# Altium schematic sheet Circuitos_digital.SchDoc
size A4
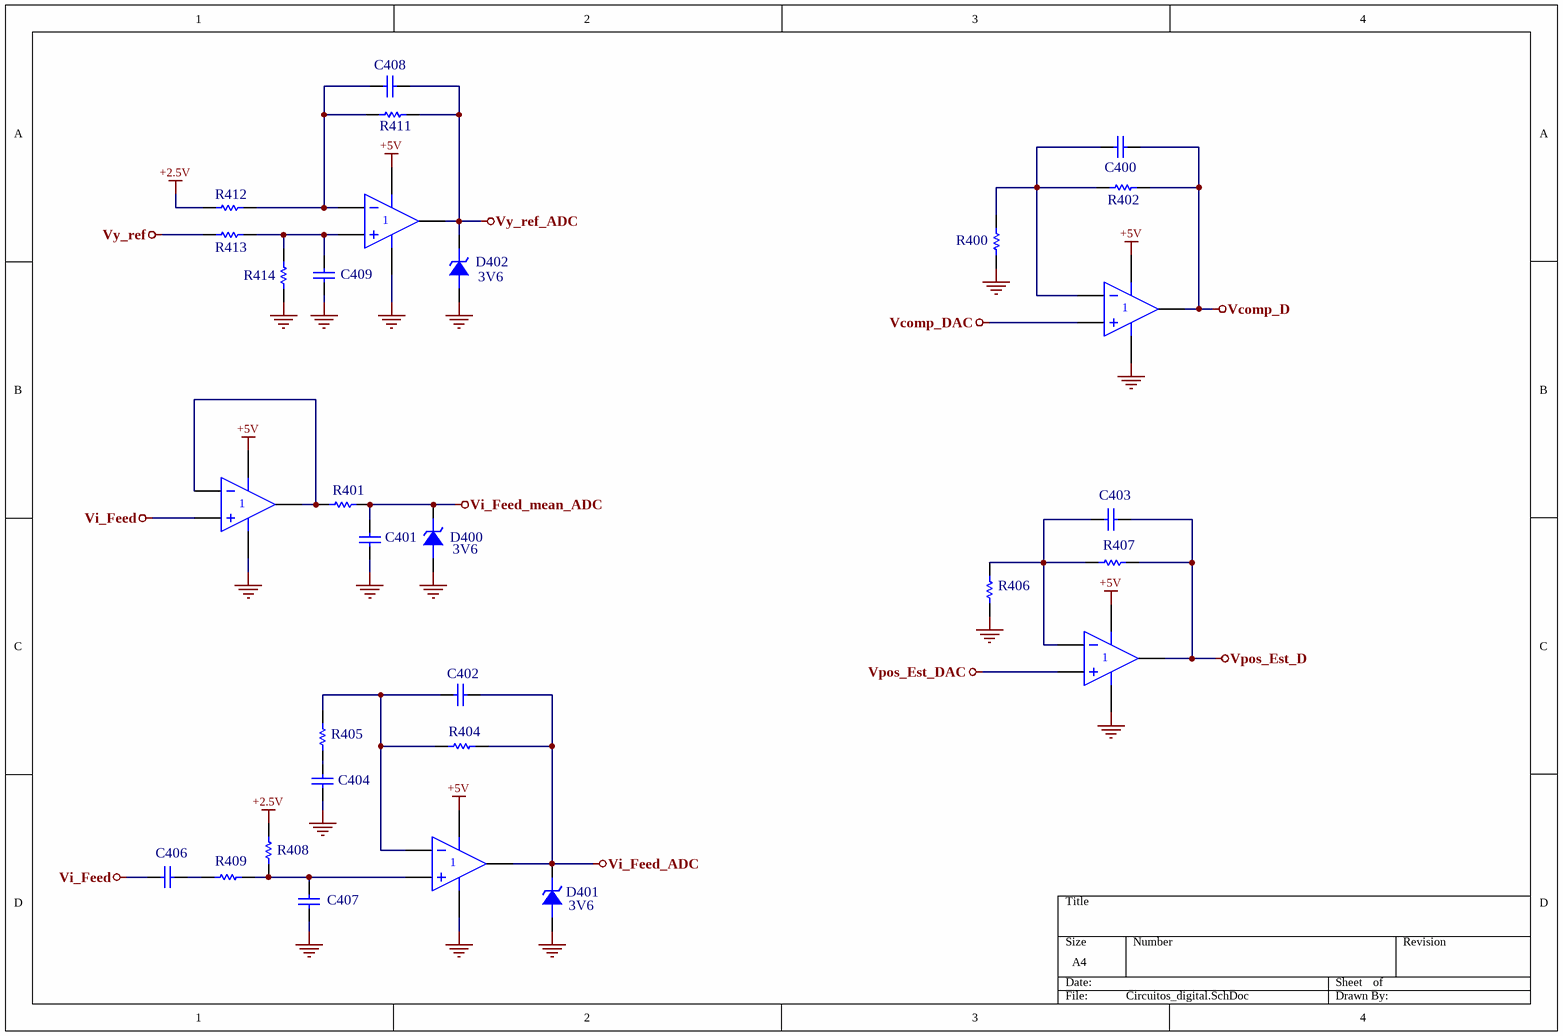
[diagram p0: Circuitos_digital.SchDoc]

## Parts
(Parts that share a designator on the sheet are numbered #1, #2 ... from top to bottom, then left to right.)
C400  Capacitor  [C1206]  (value not drawn)
C401  Capacitor  [C1206]  (value not drawn)
C402  Capacitor  [C1206]  (value not drawn)
C403  Capacitor  [C1206]  (value not drawn)
C404  Capacitor  [C1206]  (value not drawn)
C406  Capacitor  [C1206]  (value not drawn)
C407  Capacitor  [C1206]  (value not drawn)
C408  Capacitor  [C1206]  (value not drawn)
C409  Capacitor  [C1206]  (value not drawn)
D400  value 3V6  [SMB]  (hidden comment: Diodo Zener)
D401  value 3V6  [SMB]  (hidden comment: Diodo Zener)
D402  value 3V6  [SMB]  (hidden comment: Diodo Zener)
R400  10k  [R1206]  (value not drawn)
R401  10k  [R1206]  (value not drawn)
R402  5k  [R1206]  (value not drawn)
R404  50k  [R1206]  (value not drawn)
R405  1k  [R1206]  (value not drawn)
R406  10k  [R1206]  (value not drawn)
R407  5k  [R1206]  (value not drawn)
R408  50k  [R1206]  (value not drawn)
R409  1k  [R1206]  (value not drawn)
R411  10k  [R1206]  (value not drawn)
R412  10k  [R1206]  (value not drawn)
R413  10k  [R1206]  (value not drawn)
R414  10k  [R1206]  (value not drawn)
U66  MCP664  [SOIC14]  (value not drawn)  (part A of 4)
U67  MCP664  [SOIC14]  (value not drawn)  (part A of 4)
U?#1  MCP664  [SOIC14]  (value not drawn)  (part A of 4)
U?#2  MCP664  [SOIC14]  (value not drawn)  (part A of 4)
U?#3  MCP664  [SOIC14]  (value not drawn)  (part A of 4)

## Nets
+2.5V: R408.2 R412.1
+5V: U66.4(V+) U67.4(V+) U?#1.4(V+) U?#2.4(V+) U?#3.4(V+)
GND: C401.1 C404.2 C407.1 C409.2 D400.1 D401.1 D402.1 R400.1 R406.1 R414.1 U66.11(V-) U67.11(V-) U?#1.11(V-) U?#2.11(V-) U?#3.11(V-)
Vcomp_D: C400.1 R402.2 U66.1(OUT)
Vcomp_DAC: U66.3(IN+)
Vi_Feed: C406.1 U?#2.3(IN+)
Vi_Feed_ADC: C402.1 D401.2 R404.2 U?#3.1(OUT)
Vi_Feed_mean_ADC: C401.2 D400.2 R401.2
Vpos_Est_D: C403.1 R407.2 U67.1(OUT)
Vpos_Est_DAC: U67.3(IN+)
Vy_ref: R413.1
Vy_ref_ADC: C408.1 D402.2 R411.2 U?#1.1(OUT)
NetC400_2: C400.2 R400.2 R402.1 U66.2(IN-)
NetC402_2: C402.2 R404.1 R405.2 U?#3.2(IN-)
NetC403_2: C403.2 R406.2 R407.1 U67.2(IN-)
NetC404_1: C404.1 R405.1
NetC406_2: C406.2 R409.1
NetC407_2: C407.2 R408.1 R409.2 U?#3.3(IN+)
NetC408_2: C408.2 R411.1 R412.2 U?#1.2(IN-)
NetC409_1: C409.1 R413.2 R414.2 U?#1.3(IN+)
NetR401_1: R401.1 U?#2.1(OUT) U?#2.2(IN-)

## Library data of the parts
C400 C403 = Capacitor: CAP CER 0.018UF 100V X7R 1206; Mfr PN: C1206C183K1RAC7800; Manufacturer: KEMET; Value: 18nF; Supplier 1: Digi-Key; Supplier 1 PN: 399-C1206C183K1RAC7800CT-ND
C401 = Capacitor: CAP CER 0.15UF 50V X7R 1206; Mfr PN: 12065C154KAT2A; Manufacturer: KYOCERA AVX; Value: 150nF; Supplier 1: Digi-Key; Supplier 1 PN: 478-1558-1-ND
C402 C407 = Capacitor: CAP CER 270PF 50V C0G/NP0 1206; Mfr PN: C1206C271J5GAC7800; Manufacturer: KEMET; Supplier 1: Digi-Key; Supplier 1 PN: 399-14675-1-ND; Value: 270pF
C404 C406 = Capacitor: CAP CER 1.5UF 10V X7R 1206; Manufacturer: YAGEO; Mfr PN: CC1206KKX7R6BB155; Value: 1.6uF; Supplier 1: Digi-Key; Supplier 1 PN: 311-3452-1-ND
C408 C409 = Capacitor: CAP CER 1600PF 50V NP0 1206; Mfr PN: C1206C162J5GAC7800; Manufacturer: KEMET; Value: 1.6nF; Supplier 1: Digi-Key; Supplier 1 PN: 399-17466-1-ND
D400-D402 = Diodo Zener: DIODE ZENER 3.6V 3W SMB; Manufacturer: onsemi; Mfr PN: 1SMB5914BT3G; Supplier 1 PN: 1SMB5914BT3GOSCT-ND; Supplier 1: Digi-Key
R400 R401 R406 R411-R414 = R1206: RES 10K OHM 1% 1/4W 1206; Mfr PN: RC1206FR-0710KL; Manufacturer: YAGEO; PackageReference: 1206; Supplier 1 PN: 311-10.0KFRCT-ND; Supplier 1: Digi-Key; Value: 10k; Tolerance: 1%
R402 R407 = R1206: RES SMD 5K OHM 1% 0.3W 1206; Mfr PN: Y16255K00000F9W; Manufacturer: Vishay Foil Resistors (Division of Vishay Precision Group); PackageReference: 1206; Supplier 1 PN: Y16255K00000F9W-ND; Supplier 1: Digi-Key; Value: 5k; Tolerance: 1%
R404 R408 = R1206: RES SMD 50K OHM 0.1% 1/4W 1206; Mfr PN: RT1206BRD0750KL; Manufacturer: YAGEO; Supplier 1 PN: 13-RT1206BRD0750KLCT-ND; PackageReference: 1206; Supplier 1: Digi-Key; Value: 50k; Tolerance: 0.1%
R405 R409 = R1206: RES 1K OHM 1% 1/4W 1206; Mfr PN: RMCF1206FT1K00; Manufacturer: Stackpole Electronics Inc; PackageReference: 1206; Supplier 1 PN: RMCF1206FT1K00CT-ND; Supplier 1: Digi-Key; Value: 1k; Tolerance: 1%
U66 U67 U?#1-U?#3 = MCP664: IC OPAMP GP 4 CIRCUIT 14TSSOP; Mfr PN: MCP664-E/ST; Manufacturer: Microchip Technology; Datasheet: https://ar.mouser.com/datasheet/2/268/20002194E-2448650.pdf; Supplier 1: Digi-Key; Supplier 1 PN: MCP664-E/ST-ND